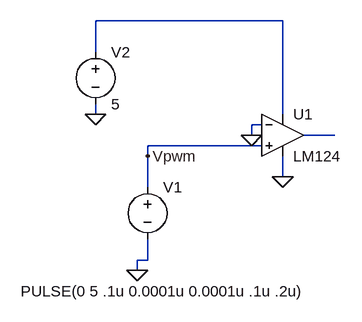
[diagram p0: schematic Draft3.asc]
Draft3.asc, the LTspice schematic file:
Version 4
SHEET 1 880 680
WIRE 288 96 0 96
WIRE 0 144 0 96
WIRE 0 240 0 224
WIRE 288 240 288 96
WIRE 256 256 240 256
WIRE 240 272 240 256
WIRE 368 272 320 272
WIRE 256 288 80 288
WIRE 80 304 80 288
WIRE 288 336 288 304
WIRE 80 352 80 304
WIRE 80 464 80 432
WIRE 80 464 64 464
WIRE 64 480 64 464
FLAG 64 480 0
FLAG 80 304 Vpwm
FLAG 0 240 0
FLAG 288 336 0
FLAG 240 272 0
SYMBOL voltage 80 336 R0
WINDOW 3 -195 176 Left 2
WINDOW 123 0 0 Left 2
WINDOW 39 0 0 Left 2
SYMATTR Value PULSE(0 5 .1u 0.0001u 0.0001u .1u .2u)
SYMATTR InstName V1
SYMBOL voltage 0 128 R0
WINDOW 123 0 0 Left 2
WINDOW 39 0 0 Left 2
SYMATTR InstName V2
SYMATTR Value 5
SYMBOL Opamps\\opamp2 288 208 R0
SYMATTR InstName U1
SYMATTR Value LM124

The netlist it stands for:
* Draft3.asc
V1 Vpwm 0 PULSE(0 5 .1u 0.0001u 0.0001u .1u .2u)
V2 N001 0 5
XU1 Vpwm 0 N001 0 N002 LM124  ; pins In+ In- V+ V- OUT
.backanno
.end